# EAGLE design sensors (EAGLE 7.6.0)
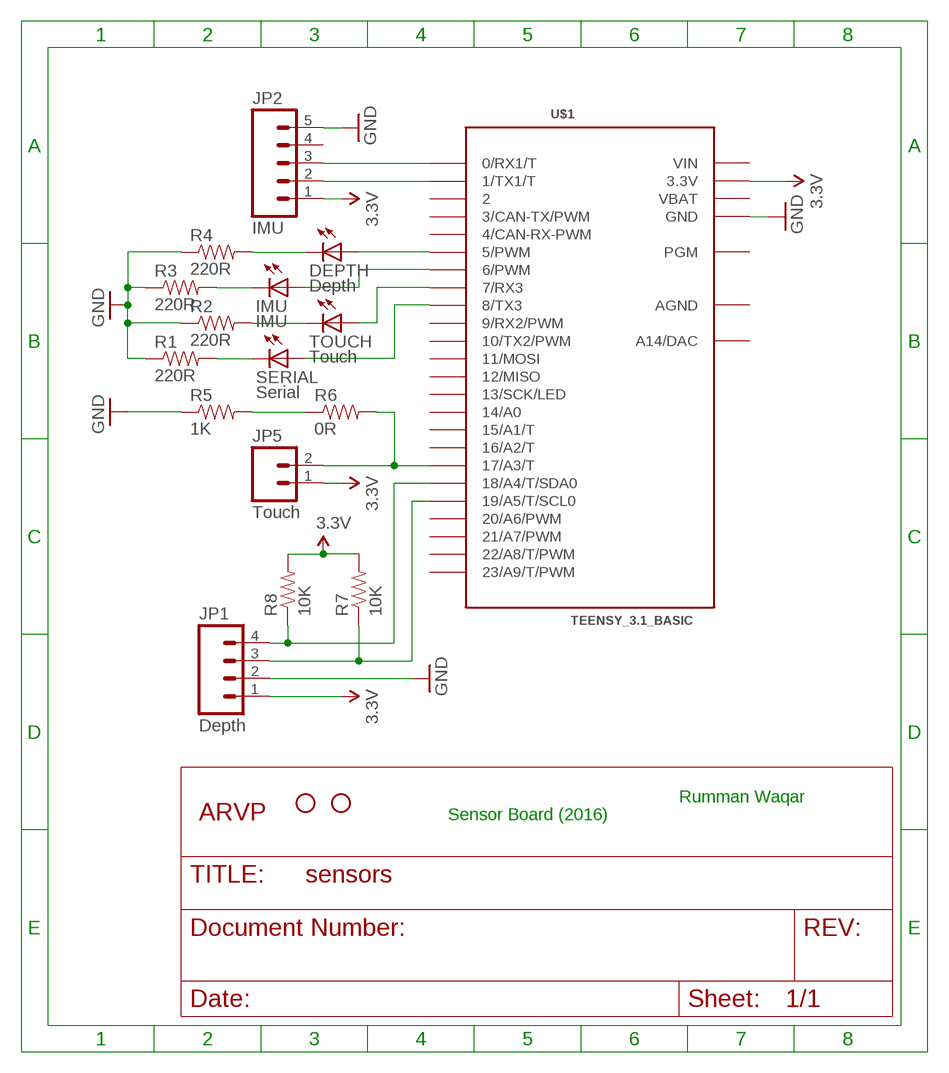
[diagram p0: schematic, sheet 1]

## Parts
DEPTH  Depth  LED1206  [LED-1206]
IMU  IMU  LED1206  [LED-1206]
JP1  Depth  M04LONGPADS  [1X04_LONGPADS]
JP2  IMU  M05PTH_LONGPADS  [1X05_LONGPADS]
JP3  STAND-OFF  [STAND-OFF]
JP4  STAND-OFF  [STAND-OFF]
JP5  Touch  M02POLAR  [MOLEX-1X2]
R1  220R  RESISTOR1206  [1206]
R2  220R  RESISTOR1206  [1206]
R3  220R  RESISTOR1206  [1206]
R4  220R  RESISTOR1206  [1206]
R5  1K  RESISTOR1206  [1206]
R6  0R  RESISTOR1206  [1206]
R7  10K  RESISTOR0805-RES  [0805]
R8  10K  RESISTOR0805-RES  [0805]
SERIAL  Serial  LED1206  [LED-1206]
TOUCH  Touch  LED1206  [LED-1206]
U$1  TEENSY_3.1_BASIC  [TEENSY_3.1_BASIC]
U$2  ARVP_LOGO  [ARVP]

## Nets
3.3V: JP1.1 JP2.1 JP5.1 R7.2 R8.2 U$1.3.3V U$1.3.3V1(3.3V)
GND: JP1.2 JP2.5 R1.1 R2.1 R3.1 R4.1 R5.1 U$1.GND U$1.GND1(GND)
N$1: DEPTH.A U$1.5(5/PWM)
N$2: DEPTH.C R4.2
N$3: IMU.C R3.2
N$4: R2.2 TOUCH.C
N$5: R1.2 SERIAL.C
N$6: IMU.A U$1.6(6/PWM)
N$7: TOUCH.A U$1.7(7/RX3)
N$8: SERIAL.A U$1.8(8/TX3)
N$9: JP2.2 U$1.1(1/TX1/T)
N$10: JP2.3 U$1.0(0/RX1/T)
N$11: JP5.2 R6.2 U$1.17/A3(17/A3/T)
N$12: R5.2 R6.1
N$13: JP1.3 R7.1 U$1.19/A5(19/A5/T/SCL0)
N$14: JP1.4 R8.1 U$1.18/A4(18/A4/T/SDA0)
Unconnected: JP2.4 U$1.2 U$1.3(3/CAN-TX/PWM) U$1.4(4/CAN-RX-PWM) U$1.9(9/RX2/PWM) U$1.10(10/TX2/PWM) U$1.11(11/MOSI) U$1.12(12/MISO) U$1.13(13/SCK/LED) U$1.14/A0 U$1.15/A1(15/A1/T) U$1.16/A2(16/A2/T) U$1.20/A6(20/A6/PWM) U$1.21/A7(21/A7/PWM) U$1.22/A8(22/A8/T/PWM) U$1.23/A9(23/A9/T/PWM) U$1.A14(A14/DAC) U$1.PGM

## Notes on the sheet
- Rumman Waqar
- Sensor Board (2016)

## Power pins joined to a net without a drawn wire
AGND: U$1.AGND
VBAT: U$1.VBAT
VIN: U$1.VIN

## Library data of the parts
DEPTH IMU SERIAL TOUCH = SparkFun:LED: LEDs Standard schematic elements and footprints for 5mm, 3mm, 1206, and 0603 sized LEDs. 5mm - Spark Fun Electronics SKU : COM-00529 (and others)
JP1 = SparkFun:M04: Header 4 Standard 4-pin 0.1" header. Use with straight break away headers (SKU : PRT-00116), right angle break away headers (PRT-00553), swiss pins (PRT-00743), machine pins (PRT-00117), and female headers (PRT-00115). Molex polarized connector foot print use with SKU : PRT-08231 with associated crimp pins and housings. 1MM SMD Version SKU: PRT-10208
JP2 = SparkFun:M05: Header 5 Standard 5-pin 0.1" header. Use with straight break away headers (SKU : PRT-00116), right angle break away headers (PRT-00553), swiss pins (PRT-00743), machine pins (PRT-00117), and female headers (PRT-00115). Molex polarized connector foot print use with SKU : PRT-08230 with associated crimp pins and housings.
JP3 JP4 = SparkFun:STAND-OFF: Stand Off This is the mechanical footprint for a #4 phillips button head screw. Use the keepout ring to avoid running the screw head into surrounding components. SKU : PRT-00447
JP5 = SparkFun:M02: Header 2 Standard 2-pin 0.1" header. Use with straight break away headers (SKU : PRT-00116), right angle break away headers (PRT-00553), swiss pins (PRT-00743), machine pins (PRT-00117), and female headers (PRT-00115). Molex polarized connector foot print use with SKU : PRT-08233 with associated crimp pins and housings.
R1-R8 = SparkFun:RESISTOR: Resistor Basic schematic elements and footprints for 0603, 1206, and PTH resistors.
U$1 = Teensy_3_Series_Board_v1.0:TEENSY_3.1_BASIC: Footprint for Teensy 3.1 board using all pin connections on the outer perimeter
U$2 = ARVP:ARVP_LOGO

## Net classes
0 default: width 0.152 mm, drill 0.254 mm, clearance 0.152 mm

## Board
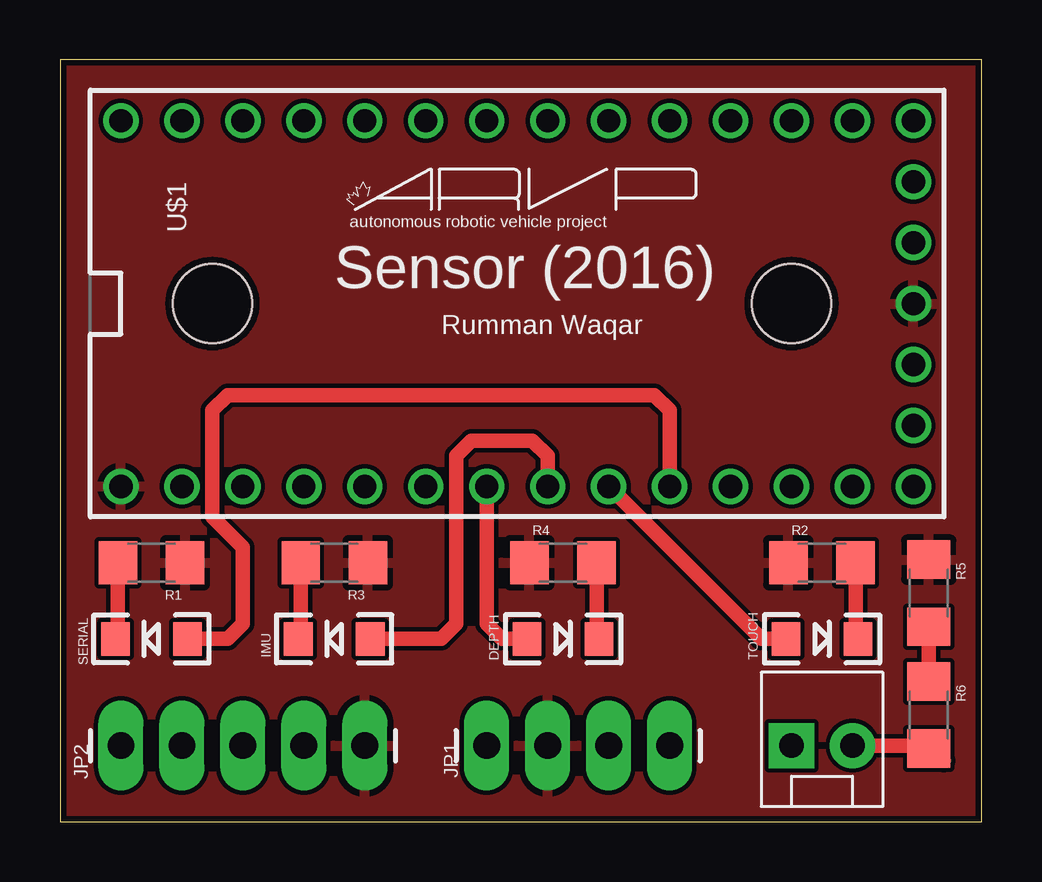
[diagram p1: board, top side]
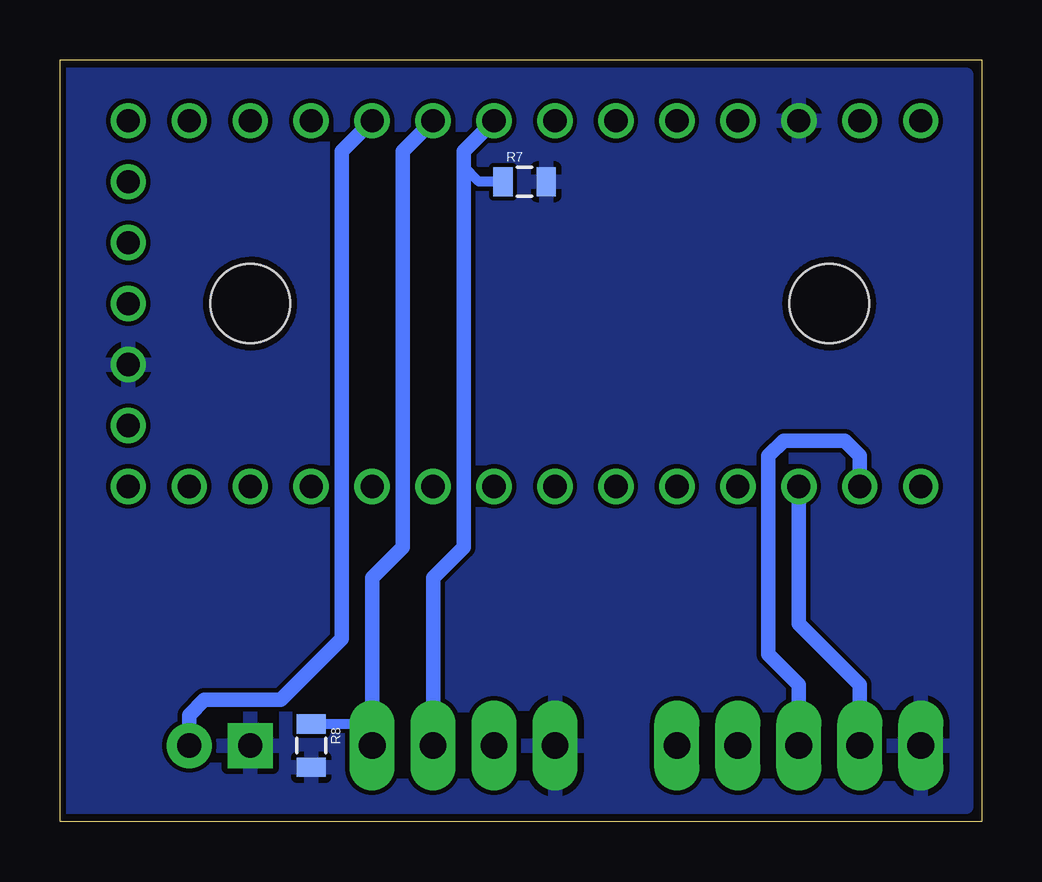
[diagram p2: board, bottom side, seen from below]

Size 38.41 x 31.74 mm. Coordinates in mm from the lower left corner, seen from the top.
Outline: 0,0 38.41,0 38.41,31.74 0,31.74 0,0
Copper layers (1*16): Top 0.035mm / dielectric 1.5mm / Bottom 0.035mm
Design rules "apcircuits": minimum track width 0.18mm, minimum drill 20mil, track to track 0.18mm, track to pad 0.18mm, pad to pad 0.18mm, via to via 0.18mm, smd to smd 0.18mm, copper to edge 0.25mm, drill to drill 0.25mm, minimum pad ring 10mil, minimum via ring 8mil, stop-mask expansion 4mil, vias tented up to drill 0mil, thermal gap 10mil

### Footprints (pad centres in the part's own frame; a part is rotated, then mirrored left to right if it is on the bottom)
LED-1206 = smd 1.2 x 1.4: A -1.5,0; C 1.5,0
1X04_LONGPADS = drill 1.118 pad 1.88 long: 1 0,0; 2 2.54,0; 3 5.08,0; 4 7.62,0
1X05_LONGPADS = drill 1.118 pad 1.88 long: 1 0,0; 2 2.54,0; 3 5.08,0; 4 7.62,0; 5 10.16,0
STAND-OFF = hole 3.302: 0,0
MOLEX-1X2 = drill 1.016 pad 1.88 square: 1 0,0 | drill 1.016 pad 1.88: 2 2.54,0
1206 = smd 1.6 x 1.8: 1 -1.4,0; 2 1.4,0
0805 = smd 0.8 x 1.2: 1 -0.9,0; 2 0.9,0
TEENSY_3.1_BASIC = drill 0.965: 0 -7.62,13.97; 1 -7.62,11.43; 2 -7.62,8.89; 3 -7.62,6.35; 3.3V 7.62,11.43; 3.3V1 -2.54,-16.51; 4 -7.62,3.81; 5 -7.62,1.27; 6 -7.62,-1.27; 7 -7.62,-3.81; 8 -7.62,-6.35; 9 -7.62,-8.89; 10 -7.62,-11.43; 11 -7.62,-13.97; 12 -7.62,-16.51; 13 7.62,-16.51; 14/A0 7.62,-13.97; 15/A1 7.62,-11.43; 16/A2 7.62,-8.89; 17/A3 7.62,-6.35; 18/A4 7.62,-3.81; 19/A5 7.62,-1.27; 20/A6 7.62,1.27; 21/A7 7.62,3.81; 22/A8 7.62,6.35; 23/A9 7.62,8.89; A14 5.08,-16.51; AGND 7.62,13.97; GND -7.62,16.51; GND1 0,-16.51; PGM 2.54,-16.51; VBAT -5.08,-16.51; VIN 7.62,16.51

### Placement (x,y rotation side)
DEPTH  20.95,7.62 0 top
IMU  11.43,7.62 180 top
JP1  17.78,3.17 0 top
JP2  2.54,3.17 0 top
JP3  30.48,21.59 0 top
JP4  6.35,21.59 0 top
JP5  30.48,3.17 0 top
R1  3.81,10.79 180 top
R2  31.75,10.79 0 top
R3  11.43,10.79 180 top
R4  20.95,10.79 0 top
R5  36.2,9.53 270 top
R6  36.2,4.45 270 top
R7  19.05,26.67 0 bottom
R8  27.94,3.17 270 bottom
SERIAL  3.81,7.62 180 top
TOUCH  31.75,7.62 0 top
U$1  19.05,21.59 90 top
U$2  12.06,24.77 0 top

### Tracks (layer width: path | path; a pad name or v marks a point on that pad's centre or on a via)
3.3V
  pour Bottom: 38.1,0.64 0.64,0.64 0.64,31.11 38.1,31.11
GND
  pour Top: 0.64,31.75 38.1,31.75 38.1,0 0,0 0,31.75
N$1
  Top 0.61: U$1.5 17.78,8.26 18.41,7.62 DEPTH.A
N$2
  Top 0.61: R4.2 22.36,7.72 DEPTH.C
N$3
  Top 0.61: IMU.C 10.03,7.62 R3.2
N$4
  Top 0.61: R2.2 33.15,7.72 TOUCH.C
N$5
  Top 0.61: SERIAL.C 2.41,7.62 R1.2
N$6
  Top 0.61: IMU.A 15.88,7.62 16.51,8.26 16.51,15.24 17.14,15.88 19.68,15.88 20.32,15.24 U$1.6
N$7
  Top 0.61: U$1.7 29.21,7.62 TOUCH.A
N$8
  Top 0.61: SERIAL.A 6.99,7.62 7.62,8.26 7.62,11.43 6.35,12.7 6.35,17.14 6.99,17.78 24.77,17.78 25.4,17.14 U$1.8
N$9
  Bottom 0.61: U$1.1 7.62,8.26 5.08,5.71 JP2.2
N$10
  Bottom 0.61: U$1.0 5.08,15.24 5.71,15.88 8.26,15.88 8.89,15.24 8.89,6.99 7.62,5.71 JP2.3
N$11
  Top 0.61: 36.83,2.54 R6.2 36.06,3.17 JP5.2
  Bottom 0.61: JP5.2 33.02,4.45 32.38,5.08 29.21,5.08 26.67,7.62 26.67,27.94 U$1.17/A3
N$12
  Top 0.61: R6.1 R5.2
N$13
  Bottom 0.406: R7.1 20.95,26.67 21.59,27.3
  Bottom 0.61: JP1.3 22.86,10.16 21.59,11.43 21.59,27.3 21.59,27.94 U$1.19/A5
N$14
  Bottom 0.406: R8.1 25.77,4.08 25.4,4.45
  Bottom 0.61: JP1.4 25.4,4.45 25.4,10.16 24.13,11.43 24.13,27.94 U$1.18/A4

### Text on the board
tPlace: Sensor (2016) | Rumman Waqar